# Altium schematic sheet PWMDriver.SchDoc
size A4; SPICEModelCacheEKQLMBQO: <root> / <DocumentId>EKQLMBQO</DocumentId> / </root>
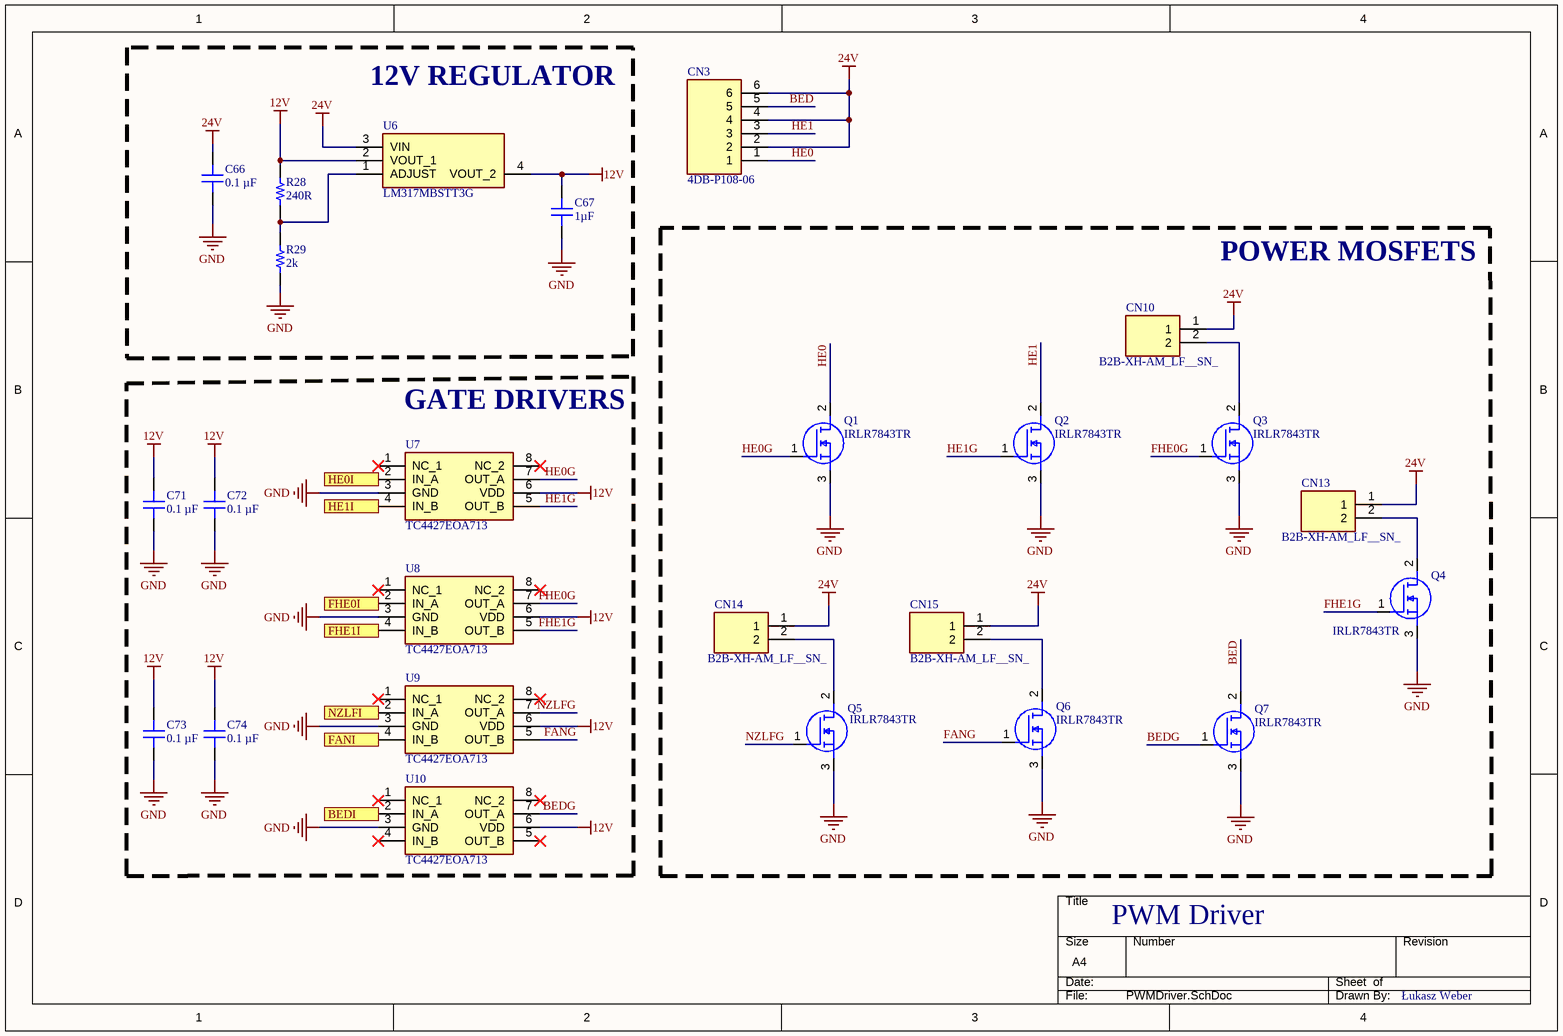
[diagram p0: PWMDriver.SchDoc]

## Parts
C66  0.1 µF  [CAP 0603_1608]
C67  1µF  [CAP 0603_1608]
C71  0.1 µF  [CAP 0603_1608]
C72  0.1 µF  [CAP 0603_1608]
C73  0.1 µF  [CAP 0603_1608]
C74  0.1 µF  [CAP 0603_1608]
CN3  4DB-P108-06  [4DBP10806]
CN10  B2B-XH-AM_LF__SN_  [B2BXHAMLFSN]
CN13  B2B-XH-AM_LF__SN_  [B2BXHAMLFSN]
CN14  B2B-XH-AM_LF__SN_  [B2BXHAMLFSN]
CN15  B2B-XH-AM_LF__SN_  [B2BXHAMLFSN]
Q1  IRLR7843TR  [IRLR7843TR]
Q2  IRLR7843TR  [IRLR7843TR]
Q3  IRLR7843TR  [IRLR7843TR]
Q4  IRLR7843TR  [IRLR7843TR]
Q5  IRLR7843TR  [IRLR7843TR]
Q6  IRLR7843TR  [IRLR7843TR]
Q7  IRLR7843TR  [IRLR7843TR]
R28  240R  [RES 0603_1608]
R29  2k  [RES 0603_1608]
U6  LM317MBSTT3G  [SOT230P700X175-4N]
U7  TC4427EOA713  [SOIC127P600X175-8N]
U8  TC4427EOA713  [SOIC127P600X175-8N]
U9  TC4427EOA713  [SOIC127P600X175-8N]
U10  TC4427EOA713  [SOIC127P600X175-8N]

## Blocks framed on the sheet
12V REGULATOR: C66 C67 R28 R29 U6
POWER MOSFETS: CN10 CN13-CN15 Q1-Q7
GATE DRIVERS: C71-C74 U7-U10

## Ports
BEDI, FANI, FHE0I, FHE1I, HE0I, HE1I, NZLFI

## Nets
12V: C67.2 C71.2 C72.2 C73.2 C74.2 R28.2 U6.2(VOUT_1) U6.4(VOUT_2) U7.6(VDD) U8.6(VDD) U9.6(VDD) U10.6(VDD)
24V: C66.2 CN3.2 CN3.4 CN3.6 CN10.1 CN13.1 CN14.1 CN15.1 U6.3(VIN)
GND: C66.1 C67.1 C71.1 C72.1 C73.1 C74.1 Q1.3(S) Q2.3(S) Q3.3(S) Q4.3(S) Q5.3(S) Q6.3(S) Q7.3(S) R29.1 U7.3(GND) U8.3(GND) U9.3(GND) U10.3(GND)
BED: CN3.5 Q7.2(D)
BEDG: Q7.1(G) U10.7(OUT_A)
BEDI: U10.2(IN_A) ; port BEDI
FANG: Q6.1(G) U9.5(OUT_B)
FANI: U9.4(IN_B) ; port FANI
FHE0G: Q3.1(G) U8.7(OUT_A)
FHE0I: U8.2(IN_A) ; port FHE0I
FHE1G: Q4.1(G) U8.5(OUT_B)
FHE1I: U8.4(IN_B) ; port FHE1I
HE0: CN3.1 Q1.2(D)
HE0G: Q1.1(G) U7.7(OUT_A)
HE0I: U7.2(IN_A) ; port HE0I
HE1: CN3.3 Q2.2(D)
HE1G: Q2.1(G) U7.5(OUT_B)
HE1I: U7.4(IN_B) ; port HE1I
NZLFG: Q5.1(G) U9.7(OUT_A)
NZLFI: U9.2(IN_A) ; port NZLFI
NetCN10_2: CN10.2 Q3.2(D)
NetCN13_2: CN13.2 Q4.2(D)
NetCN14_2: CN14.2 Q5.2(D)
NetCN15_2: CN15.2 Q6.2(D)
NetR28_1: R28.1 R29.2 U6.1(ADJUST)

Not connected (* = marked no-connect by the designer): U7 1(NC_1)* 8(NC_2)*; U8 1(NC_1)* 8(NC_2)*; U9 1(NC_1)* 8(NC_2)*; U10 1(NC_1)* 4(IN_B)* 5(OUT_B)* 8(NC_2)*

## Notes on the sheet
- PWM Driver
- Łukasz Weber
- THIS DOCUMENT AND THE DATA DISCLOSED HEREIN OR
- HEREWITH IS THE PROPERTY OF ALTIUM LIMITED AND MAY
- DWG NO:
- REVISION
- REV:
- DESCRIPTION
- DATE
- APPROVED
- BE FREELY DISTRIBUTED IN WHOLE. NO RIGHTS ARE
- RESERVED OR EXPRESS OR IMPLIED WARANTEE GIVEN.
- ENG:
- APPROVALS
- PROJECT
- DSN:
- CHK:
- REFERENCE DOCUMENTS
- PROJECT REVISION:
- TITLE
- DOCUMENT REVISION:
- DESIGN ITEM:
- BOM:
- FAB DWG:
- PCB DWG:
- ASSY DWG:
- SCALE:
- A3
- SIZE
- CAGE CODE
- FILE NAME
- DWG NO.
- SHEET
- OF
- REV

## Library data of the parts
C66 C71-C74 = 0603B104K101CT: CAP CER 0.1UF 100V X7R 0603; manufacturer: Walsin Technology Corporation; Tolerance: ±10%; Part Number: 0603B104K101CT; Value: 0.1 µF; Applications: General Purpose; Capacitance: 0.1 µF; componentlink1description: Datasheet; componentlink1url: http://www.passivecomponent.com/wp-content/uploads/2018/10/MLCC.pdf; componentlink2description: DigiKey Link; componentlink2url: https://www.digikey.com/en/products/detail/walsin-technology-corporation/0603B104K101CT/9354889; Device Package: 0603 (1608 Metric); lastupdated: 4/8/2023 7:09:18 PM; Lifecycle Status: Active; Minimum Order: 1; Mounting Type: Surface Mount, MLCC; Operating Temperature: -55°C ~ 125°C; Package / Case: 0603 (1608 Metric); packaging: TapeAndReel; partid: 4273; Part Status: Active; price: 0.01; series: -; Size / Dimension: 0.063" L x 0.031" W (1.60mm x 0.80mm); Supplier 1: DigiKey; Supplier Part Number 1: 1292-1392-1-ND; Temperature Coefficient: X7R; Thickness (Max): 0.037" (0.95mm); Voltage - Rated: 100V
C67 = 0603YD105KAT4A: CAP CER 1UF 16V X5R 0603; manufacturer: AVX Corporation; Tolerance: ±10%; Part Number: 0603YD105KAT4A; Value: 1µF; Applications: General Purpose; Capacitance: 1µF; componentlink1description: Datasheet; componentlink1url: http://datasheets.avx.com/cx5r.pdf; componentlink2description: DigiKey Link; componentlink2url: http://digikey.com/product-detail/en/avx-corporation/0603YD105KAT4A/478-10365-1-ND/6797443; Device Package: 0603 (1608 Metric); lastupdated: 9/2/2020 1:03:10 AM; Lifecycle Status: Active; Minimum Order: 1; Mounting Type: Surface Mount, MLCC; Operating Temperature: -55°C ~ 85°C; Package / Case: 0603 (1608 Metric); packaging: TapeAndReel; partid: 15257; Part Status: Active; price: 0.03; series: -; Size / Dimension: 0.063" L x 0.032" W (1.60mm x 0.81mm); Supplier 1: DigiKey; Supplier Part Number 1: 478-10365-1-ND; Temperature Coefficient: X5R; Thickness (Max): 0.035" (0.90mm); Voltage - Rated: 16V
CN3 = 4DB-P108-06: Connector; Manufacturer_Name: TE Connectivity; Datasheet Link: https://www.te.com/commerce/DocumentDelivery/DDEController?Action=srchrtrv&DocNm=2-1437667-4&DocType=Customer+Drawing&DocLang=English; Height: 13.716mm; Manufacturer_Part_Number: 4DB-P108-06; Mouser Part Number: 571-214376679; Mouser Price/Stock: https://www.mouser.com/Search/Refine.aspx?Keyword=571-214376679
CN10 CN13-CN15 = B2B-XH-AM_LF__SN_: Connector; Manufacturer_Name: JST (JAPAN SOLDERLESS TERMINALS); Manufacturer_Part_Number: B2B-XH-AM(LF)(SN); Datasheet Link: https://www.jst-mfg.com/product/pdf/eng/eXH.pdf; Height: 7mm; Arrow Part Number: B2B-XH-AM(LF)(SN); Arrow Price/Stock: https://www.arrow.com/en/products/b2b-xh-am-lf-sn/jst-manufacturing?region=europe
Q1-Q7 = IRLR7843TR: MOSFET (N-Channel); Manufacturer_Name: Infineon; Datasheet Link: https://www.infineon.com/dgdl/irlr7843.pdf?fileId=5546d462533600a40153566ddfe226d6; Height: 2.52mm; Manufacturer_Part_Number: IRLR7843TR; Mouser Part Number: N/A; Mouser Price/Stock: https://www.mouser.co.uk/ProductDetail/Infineon-IR/IRLR7843TR?qs=Gkr2N%2F2q3o0Mj9Jsrst%252Bfw%3D%3D
R28 = RCS0603240RFKEA: RES SMD 240 OHM 1% 1/4W 0603; Manufacturer: Vishay Dale; Power (Watts): 0.25W, 1/4W; Resistance: 240 Ohms; Temperature Coefficient: ±100ppm/°C; Part Number: RCS0603240RFKEA; Value: 240R; ComponentLink1Description: Datasheet; ComponentLink1URL: https://www.vishay.com/docs/20065/rcse3.pdf; ComponentLink2Description: DigiKey Link; ComponentLink2URL: https://www.digikey.com/en/products/detail/vishay-dale/RCS0603240RFKEA/5868414; Composition: Thick Film; Device Package: 0603 (1608 Metric); Features: Automotive AEC-Q200, Pulse Withstanding; Height - Seated (Max): 0.020" (0.50mm); LastUpdated: 4/8/2023 7:29:03 PM; Lifecycle Status: Active; Minimum Order: 1; Number of Terminations: 2; Operating Temperature: -55°C ~ 155°C; Package / Case: 0603 (1608 Metric); Packaging: TapeAndReel; PartId: 62490; Part Status: Active; Price: 0.02; Ratings: AEC-Q200; Series: RCS e3; Size / Dimension: 0.061" L x 0.033" W (1.55mm x 0.85mm); Supplier 1: DigiKey; Supplier Part Number 1: 541-RCS0603240RFKEACT-ND; Supplier Device Package: 0603; Tolerance: ±1%
R29 = ESR03EZPJ202: RES SMD 2K OHM 5% 1/4W 0603; Manufacturer: Rohm Semiconductor; Power (Watts): 0.25W, 1/4W; Resistance: 2 kOhms; Temperature Coefficient: ±200ppm/°C; Part Number: ESR03EZPJ202; Value: 2k; ComponentLink1Description: Datasheet; ComponentLink1URL: https://www.rohm.com/datasheet/ESR01MZPF/esr-e; ComponentLink2Description: DigiKey Link; ComponentLink2URL: https://www.digikey.com/en/products/detail/rohm-semiconductor/ESR03EZPJ202/1762725; Composition: Thick Film; Device Package: 0603 (1608 Metric); Features: Automotive AEC-Q200, Pulse Withstanding; Height - Seated (Max): 0.022" (0.55mm); LastUpdated: 4/8/2023 7:30:16 PM; Lifecycle Status: Active; Minimum Order: 1; Number of Terminations: 2; Operating Temperature: -55°C ~ 155°C; Package / Case: 0603 (1608 Metric); Packaging: TapeAndReel; PartId: 16457; Part Status: Active; Price: 0.01; Ratings: AEC-Q200; Series: ESR; Size / Dimension: 0.063" L x 0.031" W (1.60mm x 0.80mm); Supplier 1: DigiKey; Supplier Part Number 1: RHM2.0KDCT-ND; Supplier Device Package: 0603; Tolerance: ±5%
U6 = LM317MBSTT3G: Integrated Circuit; Manufacturer_Name: onsemi; Datasheet Link: http://www.farnell.com/datasheets/2058184.pdf; Height: 1.75mm; Manufacturer_Part_Number: LM317MBSTT3G; Mouser Part Number: 863-LM317MBSTT3G; Mouser Price/Stock: https://www.mouser.co.uk/ProductDetail/onsemi/LM317MBSTT3G?qs=2OtswVQKCOFxsFzIc5DGlw%3D%3D; Arrow Part Number: LM317MBSTT3G; Arrow Price/Stock: https://www.arrow.com/en/products/lm317mbstt3g/on-semiconductor?region=nac
U7-U10 = TC4427EOA713: Integrated Circuit; Manufacturer_Name: Microchip; Datasheet Link: http://www.microchip.com/mymicrochip/filehandler.aspx?ddocname=en011741; Height: 1.75mm; Manufacturer_Part_Number: TC4427EOA713; Mouser Part Number: 579-TC4427EOA713; Mouser Price/Stock: https://www.mouser.co.uk/ProductDetail/Microchip-Technology/TC4427EOA713?qs=iwvYsH9bSFbKmD8r5x5IJg%3D%3D; Arrow Part Number: TC4427EOA713; Arrow Price/Stock: https://www.arrow.com/en/products/tc4427eoa713/microchip-technology